# Altium schematic sheet 3PDT.SchDoc
size A
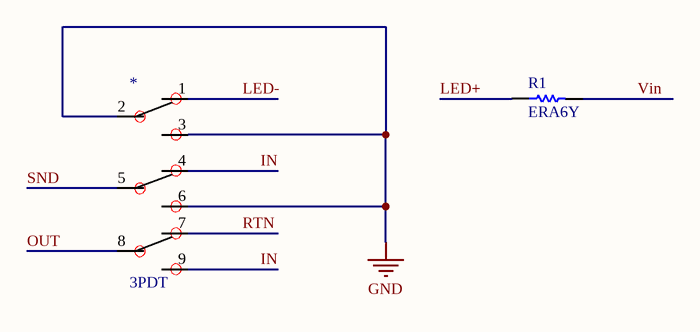
[diagram p0: 3PDT.SchDoc]

## Parts
*  3PDT  [3PDT]
R1  ERA6Y  [ERA-0805]

## Nets
GND: *.2 *.3 *.6
IN: *.4 *.9
LED+: R1.1
LED-: *.1
OUT: *.8
RTN: *.7
SND: *.5
Vin: R1.2

## Library data of the parts
R1 = ERA6Y: Rectangular Thick Film Chip Resistor, 10 Ohm to 1M Ohm Range, 0.1% and 0.5% Tolerance, 0805 Size, 0.1 W; Note: If flow soldering, adjust pad width of PCB Footprint to 0.7 - 0.8 times the width of the resistor.; Published: 17-Dec-2003; LatestRevisionDate: 19-Mar-2004; LatestRevisionNote: Silkscreen size reduced.; PackageDocument: Mar-2003; PackageReference: ERA-0805; Publisher: Altium Limited; Code_IPC: 2012 [0805]; ComponentLink1Description: Manufacturer Link; ComponentLink1URL: http://www.panasonic.com/industrial/components/resistive_products.htm; ComponentLink2Description: Datasheet; ComponentLink2URL: http://www.panasonic.com/industrial/components/pdf/AOA0000CE8.pdf